# Altium schematic sheet high_lvl_AIRs_signal.SchDoc
size A4
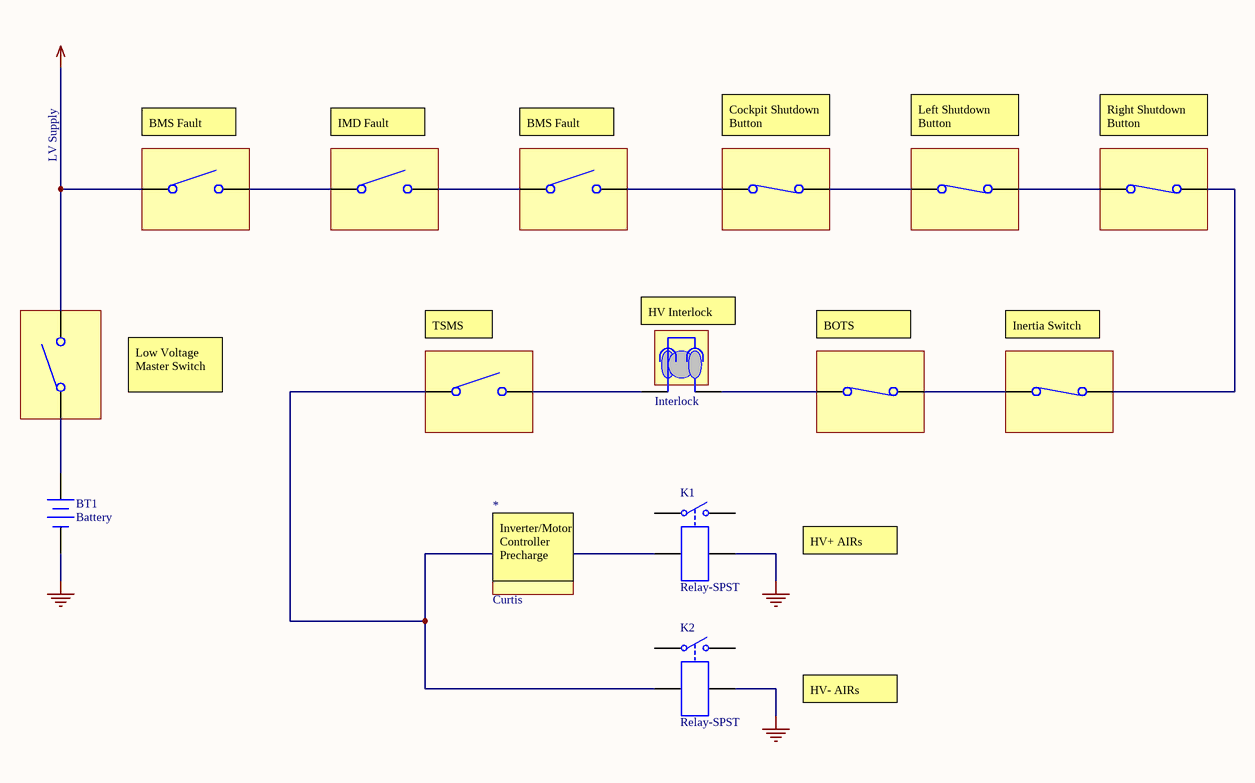
[diagram p0: high_lvl_AIRs_signal.SchDoc]

## Parts
(Parts that share a designator on the sheet are numbered #1, #2 ... from top to bottom, then left to right.)
*#1  Interlock
*#2  Curtis
BT1  Battery  [BAT-2]
K1  Relay-SPST  [MODULE4]
K2  Relay-SPST  [MODULE4]
S1  NO_contactor  (value not drawn)
S2  NO_contactor  (value not drawn)
S3  NO_contactor  (value not drawn)
S4  NC_contactor  (value not drawn)
S5  NC_contactor  (value not drawn)
S6  NC_contactor  (value not drawn)
S7  NO_contactor  (value not drawn)
S8  NO_contactor  (value not drawn)
S9  NC_contactor  (value not drawn)
S10  NC_contactor  (value not drawn)

## Nets
12V: S1.1 S7.2
GND: BT1.2(-) K1.4 K2.4
Net*#1_4: *#1.4 S9.1
NetBT1_1: BT1.1(+) S7.1
NetK2_3: K2.3 S8.1
NetS1_2: S1.2 S2.1
NetS2_2: S2.2 S3.1
NetS3_2: S3.2 S4.1
NetS4_2: S4.2 S5.1
NetS5_2: S5.2 S6.1
NetS6_2: S6.2 S10.2
NetS9_2: S9.2 S10.1

Not connected (* = marked no-connect by the designer): *#1 3; K1 1 2 3; K2 1 2; S8 2

## Notes on the sheet
- LV Supply
- BMS Fault
- IMD Fault
- Cockpit Shutdown Button
- Left Shutdown Button
- Right Shutdown Button
- HV Interlock
- Low Voltage Master Switch
- TSMS
- BOTS
- Inertia Switch
- (near *#2) Inverter/Motor Controller Precharge
- HV+ AIRs
- HV- AIRs

## Library data of the parts
BT1 = Battery: Multicell Battery; Published: 24-Mar-1999; LatestRevisionDate: 17-Jul-2002; LatestRevisionNote: Re-released for DXP Platform.; PackageReference: BAT-2; Publisher: Altium Limited; PackageDescription: Battery; 2 Leads
K1 K2 = Relay-SPST: Single-Pole Single-Throw Relay; Published: 24-Mar-1999; LatestRevisionDate: 17-Jul-2002; LatestRevisionNote: Re-released for DXP Platform.; PackageReference: MODULE4; Publisher: Altium Limited